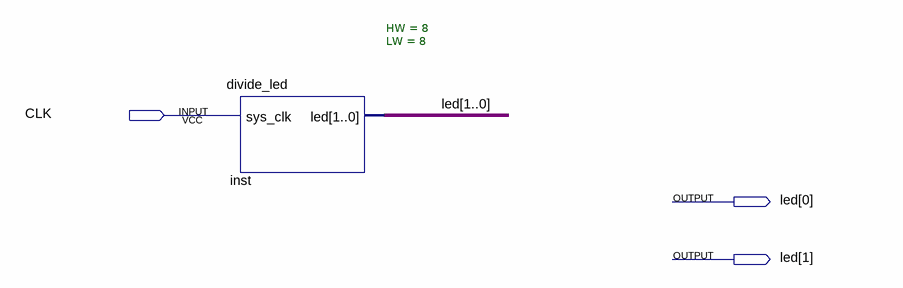
[diagram p0: schematic sheet]
// Quartus schematic COADEXP8.bdf as structural Verilog: 1 symbols, 3 pins
module COADEXP8 (
  input  CLK,
  output [1:0] led
);

  divide_led #(.HW(8), .LW(8)) inst (.sys_clk(CLK), .led(led));
endmodule
